# EAGLE design usbSimInput (EAGLE 7.2.0)
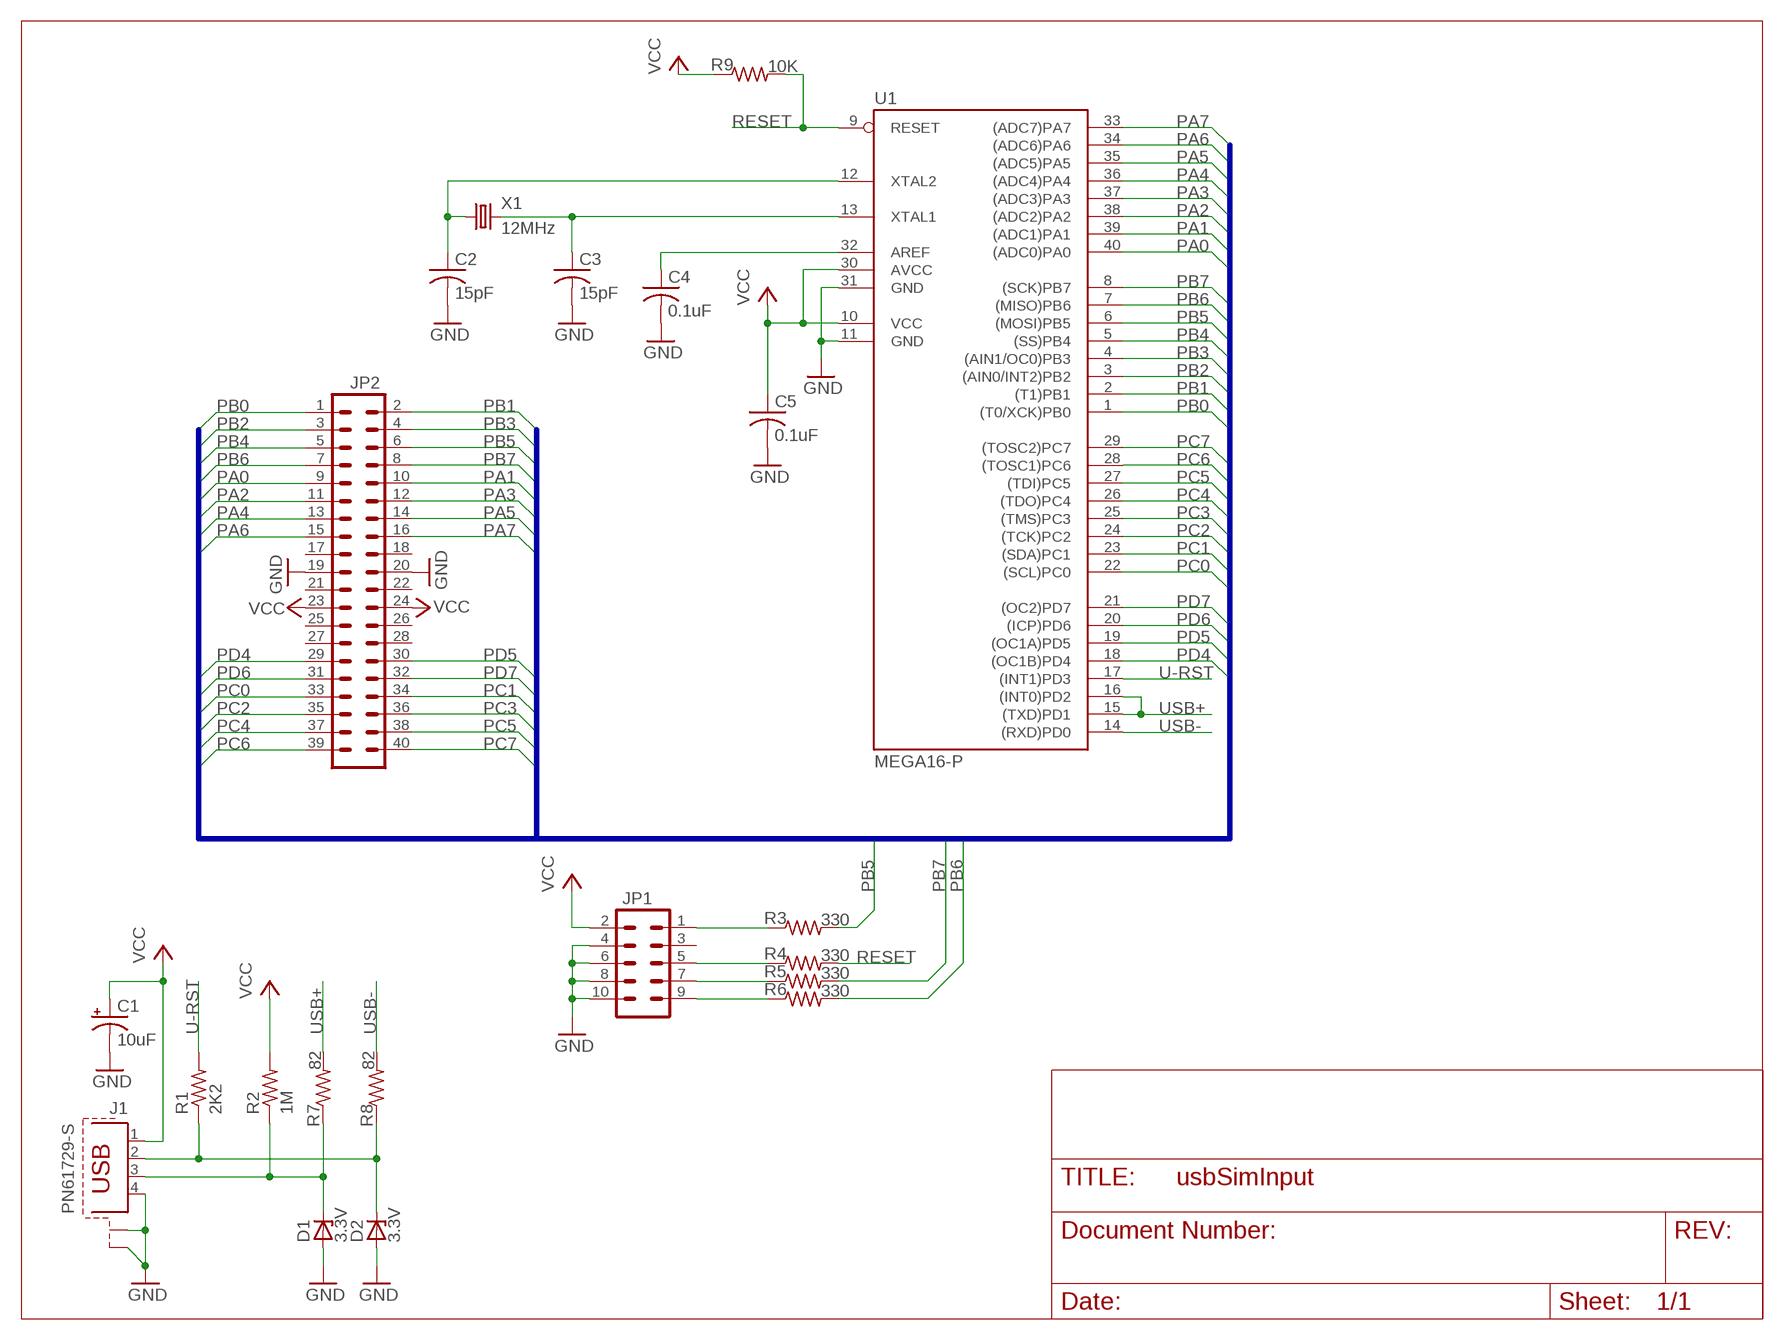
[diagram p0: schematic, sheet 1]

## Parts
C1  10uF  CPOL-USE2.5-5  [E2,5-5]
C2  15pF  C-US025-024X044  [C025-024X044]
C3  15pF  C-US025-024X044  [C025-024X044]
C4  0.1uF  C-US050-025X075  [C050-025X075]
C5  0.1uF  C-US050-025X075  [C050-025X075]
D1  3.3V  ZENER-DIODEZD-5  [ZDIO-5]
D2  3.3V  ZENER-DIODEZD-5  [ZDIO-5]
J1  PN61729-S  [PN61729-S]
JP1  ML10  [ML10]
JP2  MA20-2  [MA20-2]
R1  2K2  R-US_0207/7  [0207/7]
R2  1M  R-US_0207/7  [0207/7]
R3  330  R-US_0207/7  [0207/7]
R4  330  R-US_0207/7  [0207/7]
R5  330  R-US_0207/7  [0207/7]
R6  330  R-US_0207/7  [0207/7]
R7  82  R-US_0207/7  [0207/7]
R8  82  R-US_0207/7  [0207/7]
R9  10K  R-US_0207/7  [0207/7]
U1  MEGA16-P  [DIL40]
X1  12MHz  CRYSTALHC49U-V  [HC49U-V]

## Nets
GND: C1.- C2.2 C3.2 C4.2 C5.2 D1.A D2.A J1.4 J1.S1 J1.S2 JP1.4 JP1.6 JP1.8 JP1.10 JP2.19 JP2.20 U1.11(GND) U1.31(GND)
N$1: JP1.1 R3.1
N$2: JP1.5 R4.1
N$3: JP1.7 R5.1
N$4: JP1.9 R6.1
N$5: C3.1 U1.13(XTAL1) X1.2
N$6: C2.1 U1.12(XTAL2) X1.1
N$7: D2.C J1.2 R1.1 R8.1
N$8: C4.1 U1.32(AREF)
N$9: D1.C J1.3 R2.1 R7.1
PA0: JP2.9 U1.40((ADC0)PA0)
PA1: JP2.10 U1.39((ADC1)PA1)
PA2: JP2.11 U1.38((ADC2)PA2)
PA3: JP2.12 U1.37((ADC3)PA3)
PA4: JP2.13 U1.36((ADC4)PA4)
PA5: JP2.14 U1.35((ADC5)PA5)
PA6: JP2.15 U1.34((ADC6)PA6)
PA7: JP2.16 U1.33((ADC7)PA7)
PB0: JP2.1 U1.1((T0/XCK)PB0)
PB1: JP2.2 U1.2((T1)PB1)
PB2: JP2.3 U1.3((AIN0/INT2)PB2)
PB3: JP2.4 U1.4((AIN1/OC0)PB3)
PB4: JP2.5 U1.5((SS)PB4)
PB5: JP2.6 R3.2 U1.6((MOSI)PB5)
PB6: JP2.7 R6.2 U1.7((MISO)PB6)
PB7: JP2.8 R5.2 U1.8((SCK)PB7)
PC0: JP2.33 U1.22((SCL)PC0)
PC1: JP2.34 U1.23((SDA)PC1)
PC2: JP2.35 U1.24((TCK)PC2)
PC3: JP2.36 U1.25((TMS)PC3)
PC4: JP2.37 U1.26((TDO)PC4)
PC5: JP2.38 U1.27((TDI)PC5)
PC6: JP2.39 U1.28((TOSC1)PC6)
PC7: JP2.40 U1.29((TOSC2)PC7)
PD4: JP2.29 U1.18((OC1B)PD4)
PD5: JP2.30 U1.19((OC1A)PD5)
PD6: JP2.31 U1.20((ICP)PD6)
PD7: JP2.32 U1.21((OC2)PD7)
RESET: R4.2 R9.2 U1.9(RESET)
U-RST: R1.2 U1.17((INT1)PD3)
USB+: R7.2 U1.15((TXD)PD1) U1.16((INT0)PD2)
USB-: R8.2 U1.14((RXD)PD0)
VCC: C1.+ C5.1 J1.1 JP1.2 JP2.23 JP2.24 R2.2 R9.1 U1.10(VCC) U1.30(AVCC)
Unconnected: JP1.3 JP2.17 JP2.18 JP2.21 JP2.22 JP2.25 JP2.26 JP2.27 JP2.28

## Buses
PA[0..7],PB[0..7],PC[0..7],PD[3..7]

## Library data of the parts
C1 = rcl:CPOL-US: POLARIZED CAPACITOR, American symbol
C2-C5 = rcl:C-US: CAPACITOR, American symbol
D1 D2 = diode:ZENER-DIODE: Z-Diode
J1 = con-berg:PN61729-S: BERG USB connector; OC_FARNELL: unknown; OC_NEWARK: unknown
JP1 = con-ml:ML10: HARTING; OC_FARNELL: unknown; OC_NEWARK: unknown
JP2 = con-lstb:MA20-2: PIN HEADER; OC_FARNELL: unknown; OC_NEWARK: unknown
R1-R9 = resistor:R-US_: RESISTOR, American symbol
U1 = atmel:MEGA16-P: MICROCONTROLLER 16 Kbytes FLASH 1 kbytes SRAM 512 bytes EEPROM USART 8-channel 10 bit ADC Source: avr.lbr; MPN: ATMEGA16-16PU; OC_FARNELL: 9171142; OC_NEWARK: 01M6885
X1 = crystal:CRYSTAL: CRYSTAL; OC_FARNELL: 1666969; OC_NEWARK: unknown

## Net classes
0 default: width 0.254 mm

## Board
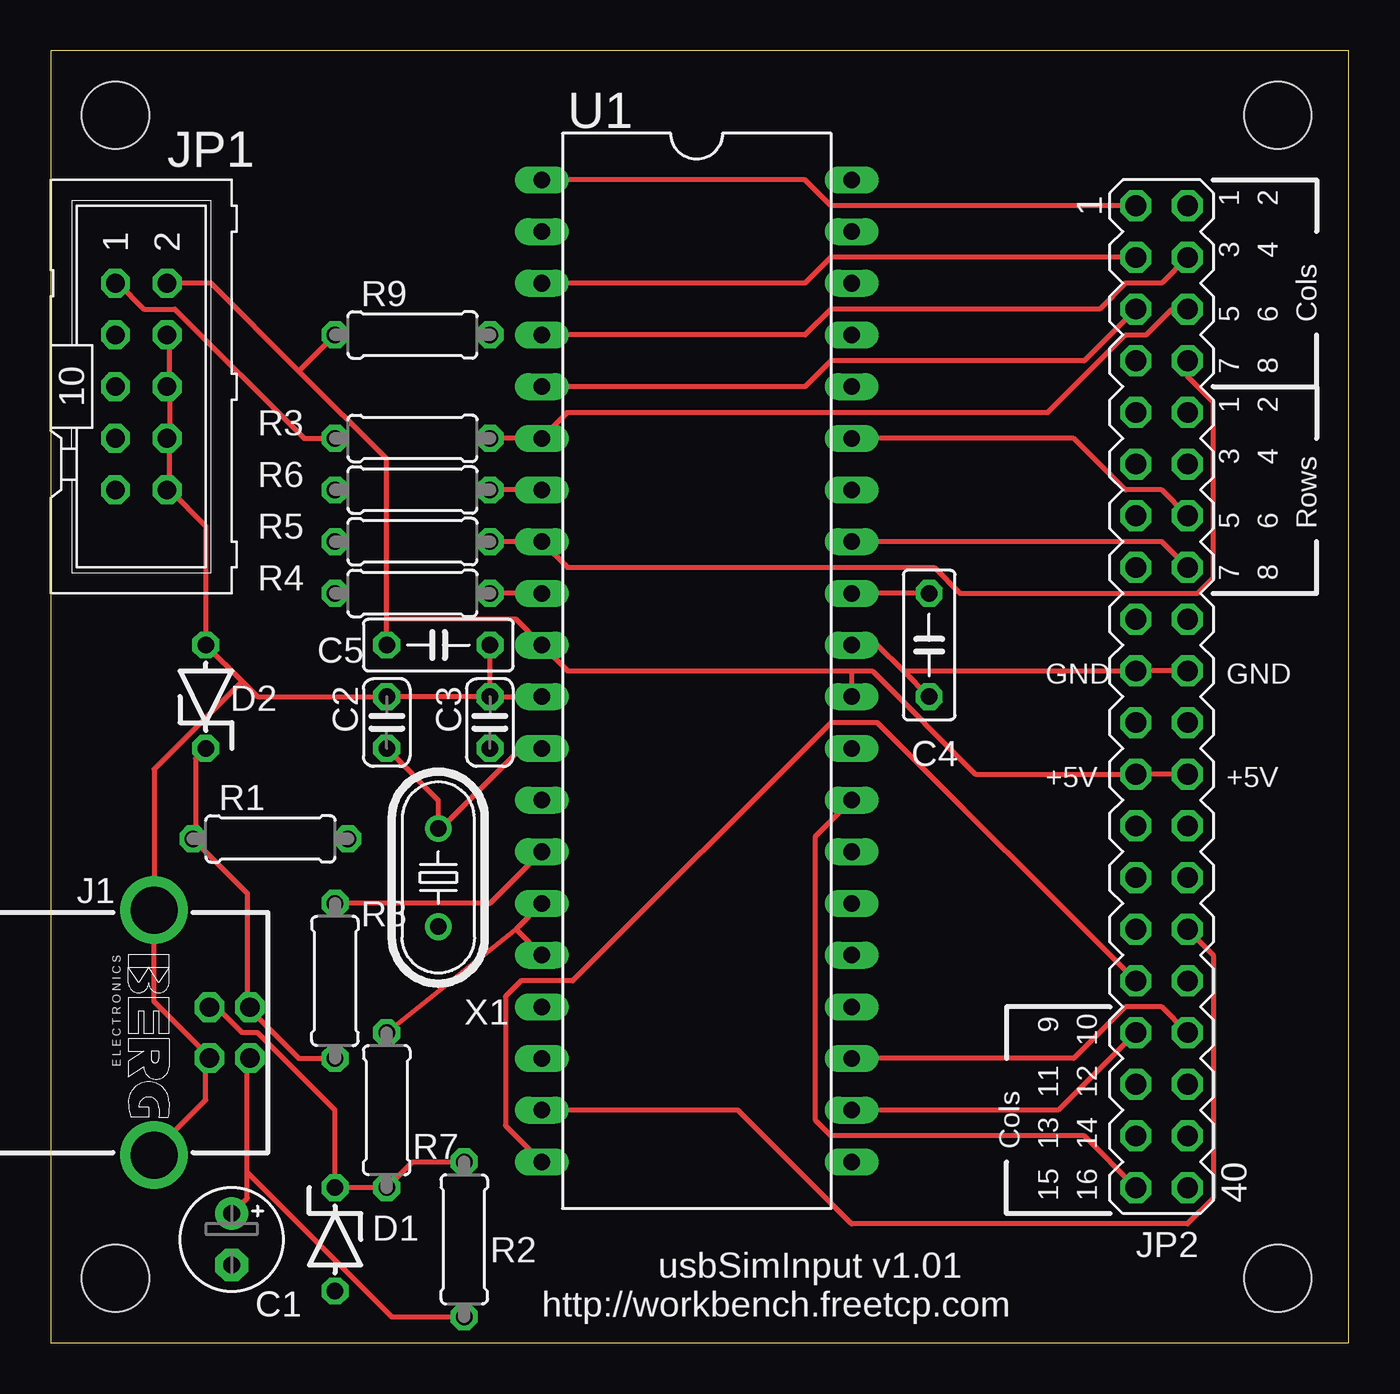
[diagram p1: board, top side]
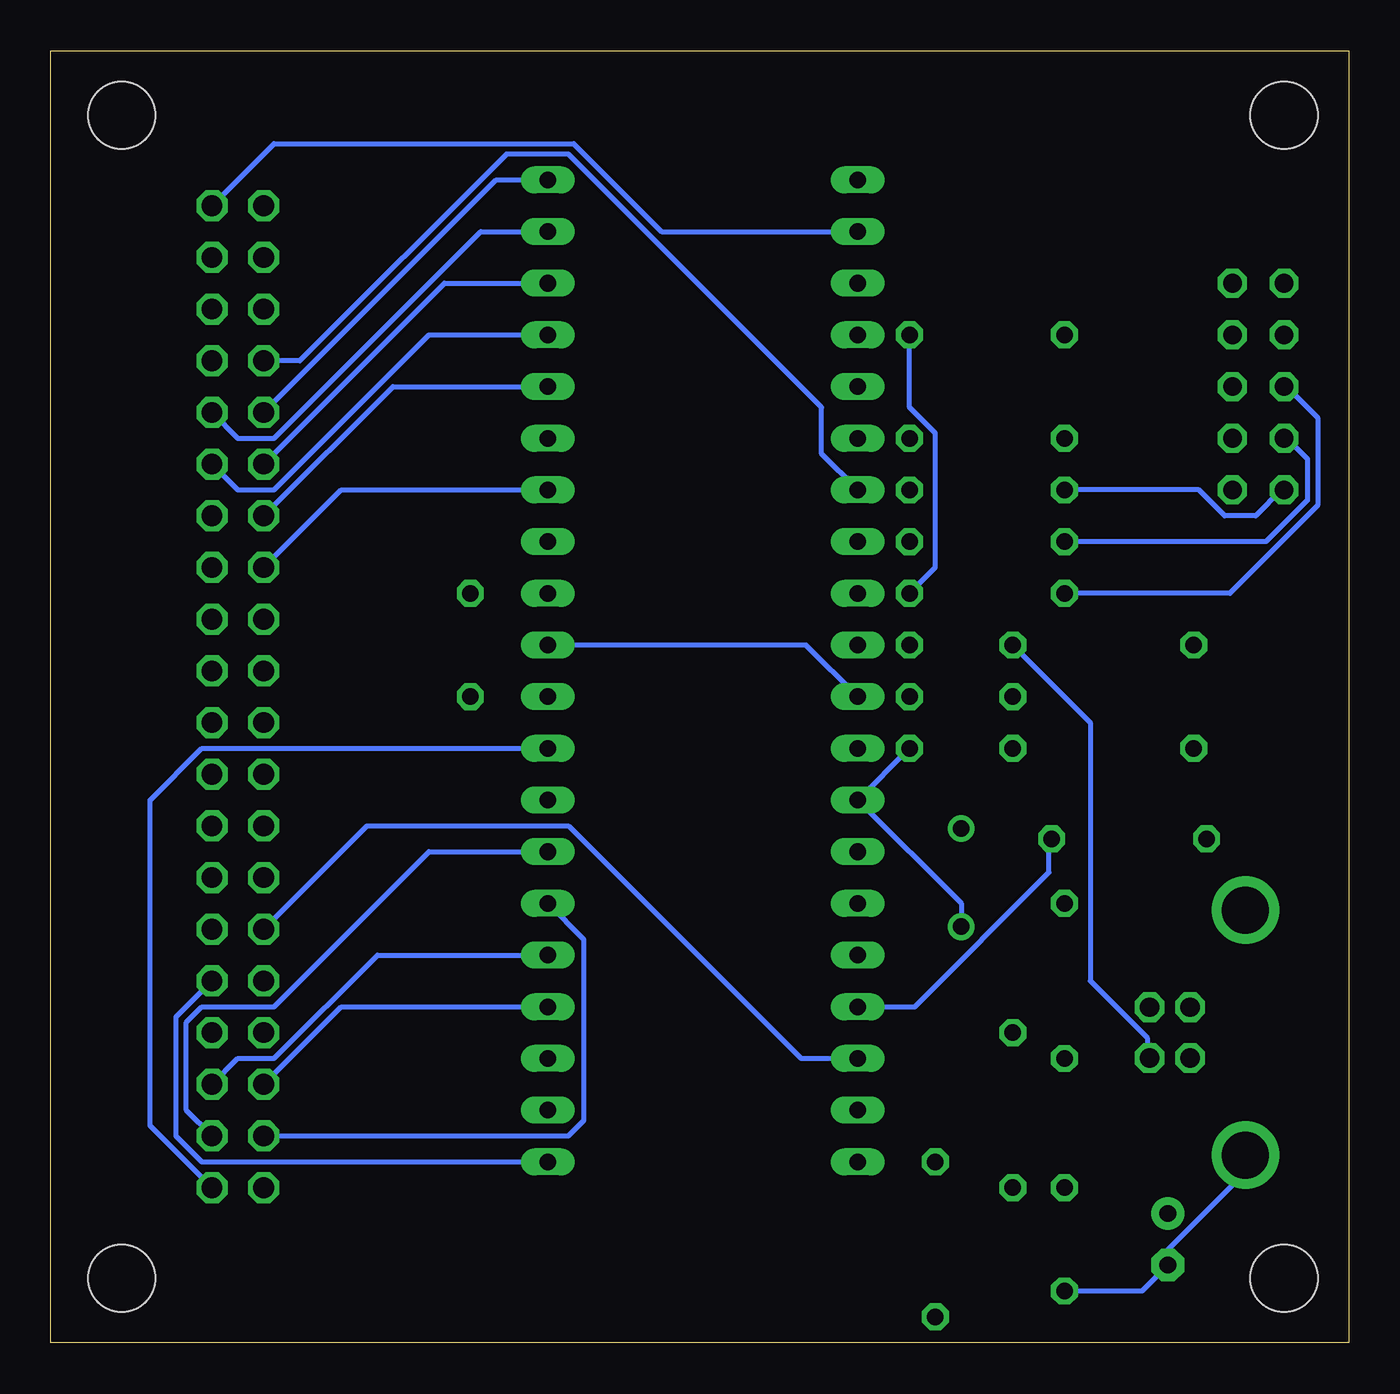
[diagram p2: board, bottom side, seen from below]

Size 63.8 x 63.49 mm. Coordinates in mm from the lower left corner, seen from the top.
Outline: 0,0 63.8,0 63.8,63.49 0,63.49 0,0
Copper layers (1*16): Top 0.035mm / dielectric 1.5mm / Bottom 0.035mm
Design rules "SeeedStudio_2layer_DRU_no_angle_20140221": minimum track width 6mil, minimum drill 12mil, track to track 6mil, track to pad 6mil, pad to pad 6mil, via to via 6mil, smd to smd 0mil, copper to edge 10mil, drill to drill 10mil, minimum pad ring 10mil, minimum via ring 6mil, stop-mask expansion 2mil, vias tented up to drill 100mil, thermal gap 10mil

### Footprints (pad centres in the part's own frame; a part is rotated, then mirrored left to right if it is on the bottom)
E2,5-5 = drill 0.813 pad 1.6: + -1.27,0 | drill 0.813 pad 1.6 octagon: - 1.27,0
C025-024X044 = drill 0.813 octagon: 1 -1.27,0; 2 1.27,0
C050-025X075 = drill 0.813 octagon: 1 -2.54,0; 2 2.54,0
ZDIO-5 = drill 0.813 octagon: A 2.54,0; C -2.54,0
PN61729-S = drill 0.95 octagon: 1 1.25,4.71; 2 -1.25,4.71; 3 -1.25,2.71; 4 1.25,2.71 | drill 2.3 pad 2.9: S1 -6.02,0; S2 6.02,0
ML10 = drill 0.914 octagon: 1 -5.08,-1.27; 2 -5.08,1.27; 3 -2.54,-1.27; 4 -2.54,1.27; 5 0,-1.27; 6 0,1.27; 7 2.54,-1.27; 8 2.54,1.27; 9 5.08,-1.27; 10 5.08,1.27
MA20-2 = drill 1.016 octagon: 1 -24.13,-1.27; 2 -24.13,1.27; 3 -21.59,-1.27; 4 -21.59,1.27; 5 -19.05,-1.27; 6 -19.05,1.27; 7 -16.51,-1.27; 8 -16.51,1.27; 9 -13.97,-1.27; 10 -13.97,1.27; 11 -11.43,-1.27; 12 -11.43,1.27; 13 -8.89,-1.27; 14 -8.89,1.27; 15 -6.35,-1.27; 16 -6.35,1.27; 17 -3.81,-1.27; 18 -3.81,1.27; 19 -1.27,-1.27; 20 -1.27,1.27; 21 1.27,-1.27; 22 1.27,1.27; 23 3.81,-1.27; 24 3.81,1.27; 25 6.35,-1.27; 26 6.35,1.27; 27 8.89,-1.27; 28 8.89,1.27; 29 11.43,-1.27; 30 11.43,1.27; 31 13.97,-1.27; 32 13.97,1.27; 33 16.51,-1.27; 34 16.51,1.27; 35 19.05,-1.27; 36 19.05,1.27; 37 21.59,-1.27; 38 21.59,1.27; 39 24.13,-1.27; 40 24.13,1.27
0207/7 = drill 0.813 octagon: 1 -3.81,0; 2 3.81,0
DIL40 = drill 0.813 long: 1 -24.13,-7.62; 2 -21.59,-7.62; 3 -19.05,-7.62; 4 -16.51,-7.62; 5 -13.97,-7.62; 6 -11.43,-7.62; 7 -8.89,-7.62; 8 -6.35,-7.62; 9 -3.81,-7.62; 10 -1.27,-7.62; 11 1.27,-7.62; 12 3.81,-7.62; 13 6.35,-7.62; 14 8.89,-7.62; 15 11.43,-7.62; 16 13.97,-7.62; 17 16.51,-7.62; 18 19.05,-7.62; 19 21.59,-7.62; 20 24.13,-7.62; 21 24.13,7.62; 22 21.59,7.62; 23 19.05,7.62; 24 16.51,7.62; 25 13.97,7.62; 26 11.43,7.62; 27 8.89,7.62; 28 6.35,7.62; 29 3.81,7.62; 30 1.27,7.62; 31 -1.27,7.62; 32 -3.81,7.62; 33 -6.35,7.62; 34 -8.89,7.62; 35 -11.43,7.62; 36 -13.97,7.62; 37 -16.51,7.62; 38 -19.05,7.62; 39 -21.59,7.62; 40 -24.13,7.62
STAND-OFF = hole 3.302: 0,0
HC49U-V = drill 0.813: 1 -2.413,0; 2 2.413,0

### Placement (x,y rotation side)
C1  8.89,5.08 270 top
C2  16.51,30.48 90 top
C3  21.59,30.48 90 top
C4  43.18,34.29 270 top
C5  19.05,34.29 0 top
D1  13.97,5.08 270 top
D2  7.62,31.75 90 top
J1  5.08,15.24 270 top
JP1  4.45,46.99 270 top
JP2  54.61,31.75 270 top
R1  10.79,24.77 0 top
R2  20.32,5.08 270 top
R3  17.78,44.45 0 top
R4  17.78,36.83 0 top
R5  17.78,39.37 0 top
R6  17.78,41.91 0 top
R7  16.51,11.43 90 top
R8  13.97,17.78 90 top
R9  17.78,49.53 0 top
U1  31.75,33.02 270 top
U$1  [STAND-OFF]  3.17,3.17 0 top
U$2  [STAND-OFF]  3.17,60.33 0 top
U$3  [STAND-OFF]  60.33,60.33 0 top
U$4  [STAND-OFF]  60.33,3.17 0 top
X1  19.05,22.86 270 top

### Tracks (layer width: path | path; a pad name or v marks a point on that pad's centre or on a via)
GND
  Top 0.254: J1.S2 5.08,9.4 7.62,11.94 7.62,13.97 J1.4 7.62,14.22 5.08,16.76 J1.S1 5.08,28.19 9.4,32.51 | JP2.20 JP2.19 41.91,33.02 | U1.31 40.64,34.29 41.91,33.02 | C4.2 41.91,33.02 | C3.2 C2.2 10.16,31.75 9.4,32.51 | C3.2 C5.2 | C3.2 U1.11 | 5.84,46.99 5.84,44.45 | 5.84,41.91 7.62,40.13 D2.A 9.4,32.51 | 5.84,41.91 5.84,44.45 | 5.84,44.45 JP1.8 | 5.84,41.91 JP1.10 | 5.84,46.99 5.84,49.53 JP1.4 | 5.84,46.99 JP1.6
  Bottom 0.254: J1.S2 5.08,8.38 8.89,4.57 C1.- 10.16,2.54 D1.A | U1.31 26.67,34.29 U1.11
N$1
  Top 0.254: R3.1 12.45,44.45 6.1,50.8 4.57,50.8 3.3,52.07 JP1.1
N$2
  Bottom 0.254: R4.1 5.84,36.83 1.52,41.15 1.52,45.47 3.05,46.99 JP1.5
N$3
  Bottom 0.254: R5.1 4.06,39.37 2.03,41.4 2.03,43.43 3.05,44.45 JP1.7
N$4
  Bottom 0.254: R6.1 7.37,41.91 6.1,40.64 4.57,40.64 3.3,41.91 JP1.9
N$5
  Bottom 0.254: X1.2 19.05,21.59 U1.13 C3.1
N$6
  Top 0.254: C2.1 19.05,26.67 X1.1 19.05,25.15 23.11,29.21 U1.12
N$7
  Top 0.254: R8.1 12.19,13.97 9.91,16.26 J1.2 9.65,16.51 9.65,22.1 R1.1 7.11,24.89 7.11,28.7 D2.C
N$8
  Top 0.254: C4.1 U1.32
N$9
  Top 0.254: J1.3 7.87,16.26 8.38,16.26 9.4,15.24 10.16,15.24 13.97,11.43 D1.C R7.1 17.78,8.89 R2.1
PA0
  Bottom 0.254: U1.40 41.91,57.15 JP2.9
PA1
  Bottom 0.254: U1.39 42.67,54.61 52.83,44.45 54.61,44.45 JP2.10
PA2
  Bottom 0.254: U1.38 44.45,52.07 JP2.11
PA3
  Bottom 0.254: U1.37 45.21,49.53 52.83,41.91 54.61,41.91 JP2.12
PA4
  Bottom 0.254: U1.36 46.99,46.99 JP2.13
PA5
  Top 0.254: U1.35 50.29,44.45 52.83,41.91 54.61,41.91 JP2.14
PA6
  Bottom 0.254: U1.34 49.53,41.91 JP2.15
PA7
  Top 0.254: U1.33 54.61,39.37 JP2.16
PB0
  Top 0.254: U1.1 37.08,57.15 38.35,55.88 JP2.1
PB1
  Bottom 0.254: U1.2 33.78,54.61 38.1,58.93 52.83,58.93 JP2.2
PB2
  Top 0.254: U1.3 37.08,52.07 38.35,53.34 JP2.3
PB3
  Top 0.254: U1.4 37.08,49.53 38.35,50.8 51.56,50.8 52.83,52.07 54.61,52.07 JP2.4
PB4
  Top 0.254: U1.5 37.08,46.99 38.35,48.26 50.8,48.26 JP2.5
PB5
  Top 0.254: R3.2 U1.6 25.4,45.72 49.02,45.72 52.83,49.53 53.85,49.53 55.12,50.8 JP2.6
PB6
  Top 0.254: U1.7 R6.2
  Bottom 0.254: JP2.7 51.56,48.26 41.4,58.42 38.35,58.42 25.91,45.97 25.91,43.69 U1.7
PB7
  Top 0.254: R5.2 U1.8 25.4,38.1 43.43,38.1 44.7,36.83 56.39,36.83 57.15,37.59 57.15,46.23 55.88,47.5 JP2.8
PC0
  Top 0.254: U1.22 49.53,11.43 JP2.33
PC1
  Top 0.254: U1.23 50.29,13.97 52.83,16.51 54.61,16.51 JP2.34
PC2
  Bottom 0.254: U1.24 49.53,16.51 JP2.35
PC3
  Bottom 0.254: U1.25 47.75,19.05 52.83,13.97 54.61,13.97 JP2.36
PC4
  Bottom 0.254: U1.26 37.59,19.81 37.59,10.92 38.35,10.16 JP2.37
PC5
  Bottom 0.254: U1.27 45.21,24.13 52.83,16.51 56.39,16.51 57.15,15.75 57.15,11.43 JP2.38
PC6
  Top 0.254: U1.28 37.59,24.89 37.59,10.92 38.35,10.16 50.8,10.16 JP2.39
PC7
  Bottom 0.254: U1.29 56.39,29.21 58.93,26.67 58.93,10.67 JP2.40
PD4
  Bottom 0.254: U1.18 26.92,13.97 38.35,25.4 48.26,25.4 JP2.29
PD5
  Top 0.254: U1.19 33.78,11.43 39.37,5.84 55.88,5.84 57.15,7.11 57.15,19.05 JP2.30
PD6
  Top 0.254: U1.20 22.35,10.67 22.35,17.02 23.11,17.78 25.65,17.78 38.35,30.48 40.64,30.48 JP2.31
PD7
  Bottom 0.254: U1.21 56.39,8.89 57.66,10.16 57.66,16 JP2.32
RESET
  Top 0.254: U1.9 R4.2
  Bottom 0.254: R9.2 21.59,45.97 20.32,44.7 20.32,38.1 R4.2
U-RST
  Bottom 0.254: U1.17 21.34,16.51 14.73,23.11 14.73,24.64 R1.2
USB+
  Top 0.254: U1.15 22.86,20.32 | 22.86,20.32 R7.2 | 22.86,20.32 U1.16
USB-
  Top 0.254: R8.2 21.59,21.59 U1.14
VCC
  Top 0.254: 9.65,8.38 9.65,7.11 C1.+ | 9.65,8.38 9.65,13.97 J1.1 | JP2.24 JP2.23 45.47,27.94 40.39,33.02 39.37,33.02 | JP1.2 7.87,52.07 12.19,47.75 | 12.19,47.75 16.51,43.43 16.51,35.56 | C5.1 16.51,35.56 | 39.37,33.02 25.4,33.02 U1.10 22.86,35.56 16.51,35.56 | 12.19,47.75 R9.1 | R2.2 16.76,1.27 9.65,8.38 | 39.37,33.02 U1.30
  Bottom 0.254: C5.1 12.7,30.48 12.7,17.78 9.91,14.99 9.91,14.22 J1.1

### Text on the board
tPlace: 1 | 2 | 3 | 4 | 5 | 6 | Cols | 7 | 8 | 1 | 2 | 3 | 4 | 5 | 6 | Rows | 7 | 8 | GND | GND | +5V | +5V | 9 | 10 | 11 | 12 | Cols | 13 | 14 | 15 | 16 | usbSimInput v1.01 | http://workbench.freetcp.com